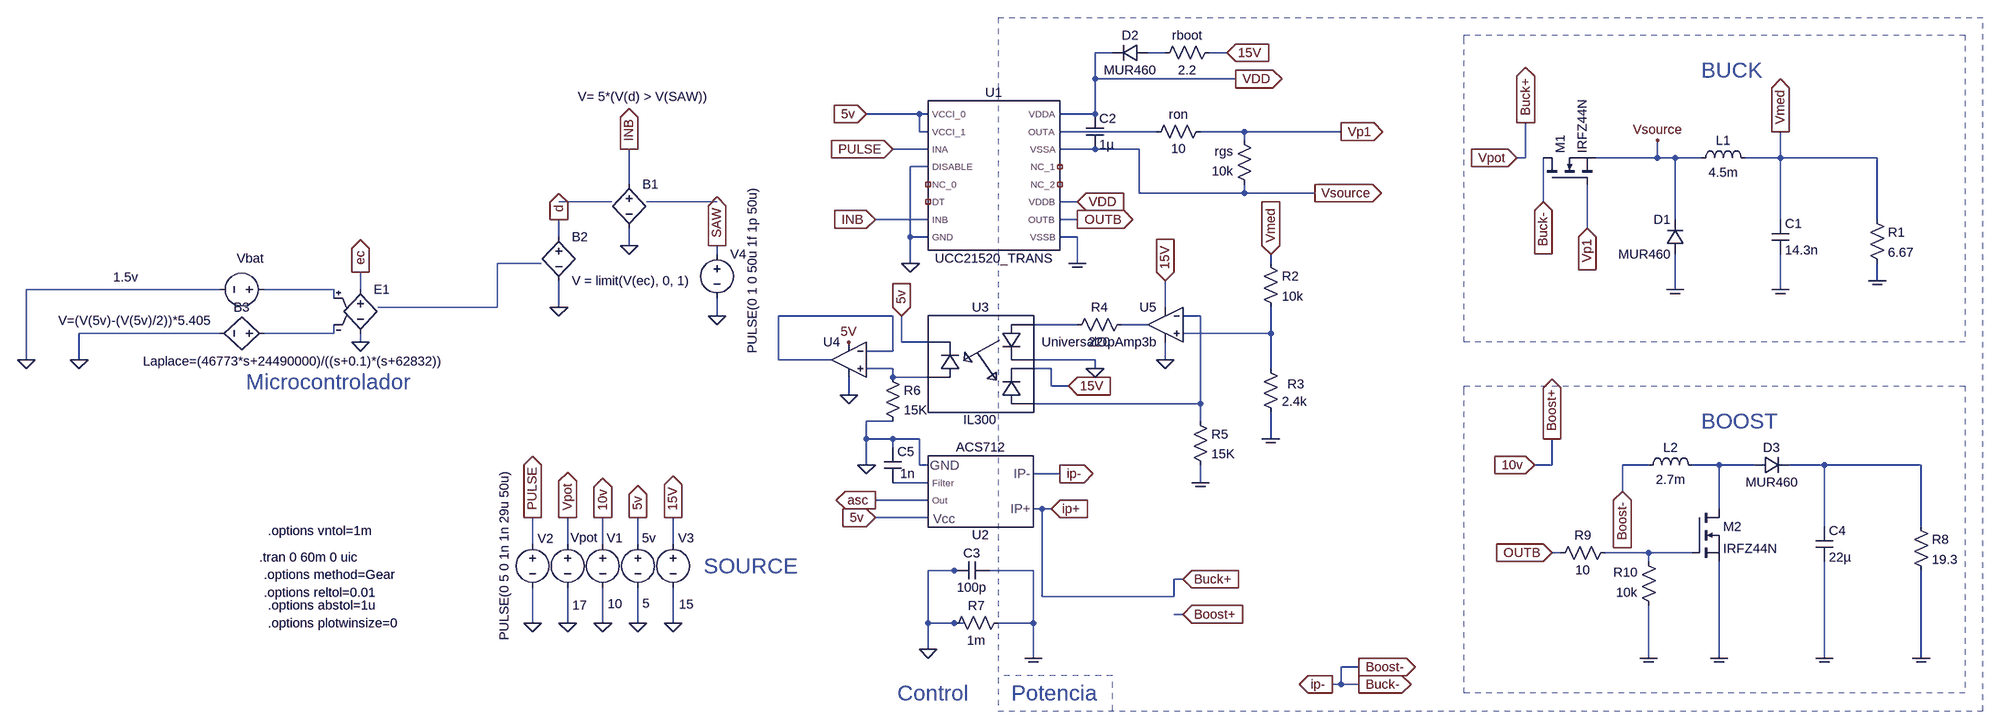
[diagram p0: schematic buckboost.asc]
buckboost.asc, the LTspice schematic file:
Version 4.1
SHEET 1 2232 1744
WIRE 208 192 176 192
WIRE 304 192 272 192
WIRE 416 192 384 192
WIRE 176 240 176 192
WIRE 432 240 176 240
WIRE -144 304 -240 304
WIRE -128 304 -144 304
WIRE 176 304 176 240
WIRE 176 304 112 304
WIRE -144 336 -144 304
WIRE -128 336 -144 336
WIRE 288 336 112 336
WIRE 448 336 368 336
WIRE 624 336 448 336
WIRE 448 352 448 336
WIRE -128 368 -192 368
WIRE 176 368 112 368
WIRE 256 368 176 368
WIRE 960 384 960 320
WIRE 960 384 944 384
WIRE 1200 384 1200 352
WIRE 1200 384 1088 384
WIRE 1232 384 1200 384
WIRE 1280 384 1232 384
WIRE 1424 384 1424 336
WIRE 1424 384 1360 384
WIRE 1600 384 1424 384
WIRE -128 400 -160 400
WIRE -672 432 -672 368
WIRE 256 448 256 368
WIRE 448 448 448 432
WIRE 448 448 256 448
WIRE 576 448 448 448
WIRE 144 464 112 464
WIRE 992 464 992 384
WIRE -128 496 -224 496
WIRE 144 496 112 496
WIRE 1232 496 1232 384
WIRE 1424 496 1424 384
WIRE 1600 496 1600 384
WIRE 1072 512 1072 432
WIRE -800 528 -800 496
WIRE -160 528 -160 400
WIRE -128 528 -160 528
WIRE 144 528 112 528
WIRE -672 544 -672 512
WIRE -512 560 -512 544
WIRE -160 576 -160 528
WIRE 144 576 144 528
WIRE 496 576 496 560
WIRE 1600 608 1600 576
WIRE -1424 624 -1776 624
WIRE -1216 624 -1344 624
WIRE -1168 624 -1168 592
WIRE 1232 624 1232 560
WIRE 1424 624 1424 560
WIRE -1216 640 -1216 624
WIRE -800 656 -800 608
WIRE 304 656 304 608
WIRE -512 672 -512 640
WIRE -192 672 -400 672
WIRE 368 672 336 672
WIRE 144 688 64 688
WIRE 272 688 224 688
WIRE -1424 704 -1680 704
WIRE -1216 704 -1216 688
WIRE -1216 704 -1344 704
WIRE 496 704 496 656
WIRE 496 704 336 704
WIRE -1168 720 -1168 704
WIRE -176 720 -176 672
WIRE -128 720 -176 720
WIRE -192 736 -192 672
WIRE -192 736 -240 736
WIRE -1776 752 -1776 624
WIRE -1680 752 -1680 704
WIRE -400 752 -400 672
WIRE -304 752 -400 752
WIRE 176 752 64 752
WIRE 304 752 304 720
WIRE -192 768 -240 768
WIRE 96 768 64 768
WIRE 176 768 176 752
WIRE 496 768 496 704
WIRE -192 784 -192 768
WIRE -128 784 -192 784
WIRE 96 800 96 768
WIRE 128 800 96 800
WIRE -272 816 -272 784
WIRE 368 832 368 672
WIRE 368 832 64 832
WIRE -192 864 -240 864
WIRE 368 864 368 832
WIRE -240 896 -240 864
WIRE -192 896 -240 896
WIRE -144 896 -192 896
WIRE 496 896 496 848
WIRE -192 912 -192 896
WIRE -240 944 -240 896
WIRE -144 944 -144 896
WIRE -128 944 -144 944
WIRE 1008 944 1008 896
WIRE 1008 944 976 944
WIRE 1184 944 1136 944
WIRE 1312 944 1264 944
WIRE 1376 944 1312 944
WIRE 1504 944 1440 944
WIRE 1680 944 1504 944
WIRE 112 960 64 960
WIRE -128 976 -192 976
WIRE 368 976 368 944
WIRE 1136 992 1136 944
WIRE -128 1008 -224 1008
WIRE 80 1024 64 1024
WIRE 96 1024 80 1024
WIRE 1312 1024 1312 944
WIRE -128 1040 -224 1040
WIRE 1504 1056 1504 944
WIRE 1680 1056 1680 944
WIRE -848 1088 -848 1040
WIRE -784 1088 -784 1040
WIRE -720 1088 -720 1040
WIRE -656 1088 -656 1040
WIRE -592 1088 -592 1040
WIRE 1024 1104 1008 1104
WIRE 1184 1104 1104 1104
WIRE 1264 1104 1184 1104
WIRE 1184 1120 1184 1104
WIRE -80 1136 -128 1136
WIRE -64 1136 -80 1136
WIRE 64 1136 -16 1136
WIRE 336 1152 320 1152
WIRE 80 1184 80 1024
WIRE 320 1184 320 1152
WIRE 320 1184 80 1184
WIRE 336 1216 320 1216
WIRE -848 1232 -848 1168
WIRE -784 1232 -784 1168
WIRE -720 1232 -720 1168
WIRE -656 1232 -656 1168
WIRE -592 1232 -592 1168
WIRE -128 1232 -128 1136
WIRE -80 1232 -128 1232
WIRE -64 1232 -80 1232
WIRE 64 1232 64 1136
WIRE 64 1232 0 1232
WIRE -128 1280 -128 1232
WIRE 64 1296 64 1232
WIRE 1184 1296 1184 1200
WIRE 1312 1296 1312 1120
WIRE 1504 1296 1504 1120
WIRE 1680 1296 1680 1136
WIRE 656 1312 624 1312
WIRE 624 1344 624 1312
WIRE 624 1344 608 1344
WIRE 656 1344 624 1344
FLAG 1232 624 COM
FLAG -848 1232 0
FLAG -848 1040 PULSE
IOPIN -848 1040 Out
FLAG -192 368 PULSE
IOPIN -192 368 In
FLAG -240 304 5v
IOPIN -240 304 In
FLAG -656 1040 5v
IOPIN -656 1040 Out
FLAG 1072 512 Vp1
IOPIN 1072 512 In
FLAG -592 1232 0
FLAG 144 576 COM
FLAG 432 240 VDD
IOPIN 432 240 Out
FLAG 144 464 VDD
IOPIN 144 464 In
FLAG 624 336 Vp1
IOPIN 624 336 Out
FLAG 576 448 Vsource
IOPIN 576 448 Out
FLAG 1200 352 Vsource
FLAG 1424 336 Vmed
IOPIN 1424 336 Out
FLAG 496 560 Vmed
IOPIN 496 560 In
FLAG -592 1040 15V
IOPIN -592 1040 Out
FLAG 128 800 15V
IOPIN 128 800 In
FLAG 496 896 COM
FLAG 368 976 COM
FLAG 304 608 15V
IOPIN 304 608 In
FLAG -272 720 5V
FLAG -272 816 0
FLAG 304 752 0
FLAG -240 944 0
FLAG 176 768 0
FLAG -656 1232 0
FLAG -160 576 0
FLAG -176 672 5v
IOPIN -176 672 In
FLAG 416 192 15V
IOPIN 416 192 In
FLAG -784 1232 0
FLAG 1424 624 COM
FLAG 1600 608 COM
FLAG -784 1040 Vpot
IOPIN -784 1040 Out
FLAG 944 384 Vpot
IOPIN 944 384 In
FLAG -128 1280 0
FLAG 64 1296 COM
FLAG 1312 1296 COM
FLAG 1504 1296 COM
FLAG 1680 1296 COM
FLAG 976 944 10v
IOPIN 976 944 In
FLAG -720 1040 10v
IOPIN -720 1040 Out
FLAG -720 1232 0
FLAG 1184 1296 COM
FLAG 1008 1104 OUTB
IOPIN 1008 1104 In
FLAG 144 496 OUTB
IOPIN 144 496 Out
FLAG -512 672 0
FLAG -512 544 SAW
IOPIN -512 544 Out
FLAG -672 544 0
FLAG -672 368 INB
IOPIN -672 368 Out
FLAG -224 496 INB
IOPIN -224 496 In
FLAG -800 656 0
FLAG -800 496 d
IOPIN -800 496 Out
FLAG -1680 752 0
FLAG -1168 592 ec
IOPIN -1168 592 Out
FLAG -1776 752 0
FLAG -224 1008 asc
IOPIN -224 1008 Out
FLAG 96 1024 ip+
IOPIN 96 1024 In
FLAG 112 960 ip-
IOPIN 112 960 Out
FLAG 1008 896 Boost+
IOPIN 1008 896 Out
FLAG 1136 992 Boost-
IOPIN 1136 992 In
FLAG -224 1040 5v
IOPIN -224 1040 In
FLAG -1168 720 0
FLAG 960 320 Buck+
IOPIN 960 320 Out
FLAG 992 464 Buck-
IOPIN 992 464 In
FLAG 336 1152 Buck+
IOPIN 336 1152 In
FLAG 656 1344 Buck-
IOPIN 656 1344 Out
FLAG 336 1216 Boost+
IOPIN 336 1216 In
FLAG 656 1312 Boost-
IOPIN 656 1312 Out
FLAG 608 1344 ip-
IOPIN 608 1344 Out
SYMBOL voltage -784 1072 R0
WINDOW 123 0 0 Left 0
WINDOW 39 0 0 Left 0
WINDOW 0 5 4 Left 2
WINDOW 3 9 128 Left 2
SYMATTR InstName Vpot
SYMATTR Value 17
SYMBOL voltage -848 1072 R0
WINDOW 123 0 0 Left 0
WINDOW 39 0 0 Left 0
WINDOW 3 -51 -118 VRight 2
WINDOW 0 9 6 Left 2
SYMATTR Value PULSE(0 5 0 1n 1n 29u 50u)
SYMATTR InstName V2
SYMBOL diode 1248 560 R180
WINDOW 0 24 64 Left 2
WINDOW 3 24 0 Left 2
SYMATTR InstName D1
SYMATTR Value MUR460
SYMBOL cap 1408 496 R0
SYMATTR InstName C1
SYMATTR Value 14.3n
SYMBOL ind 1264 400 R270
WINDOW 0 32 56 VTop 2
WINDOW 3 5 56 VBottom 2
SYMATTR InstName L1
SYMATTR Value 4.5m
SYMATTR SpiceLine Rser=1m
SYMBOL res 1584 480 R0
SYMATTR InstName R1
SYMATTR Value 6.67
SYMBOL UCC21520_TRANS -16 416 R0
SYMATTR InstName U1
SYMBOL res 288 208 R270
WINDOW 0 32 56 VTop 2
WINDOW 3 0 56 VBottom 2
SYMATTR InstName rboot
SYMATTR Value 2.2
SYMBOL res 384 320 R90
WINDOW 0 0 56 VBottom 2
WINDOW 3 32 56 VTop 2
SYMATTR InstName ron
SYMATTR Value 10
SYMBOL res 464 448 R180
WINDOW 0 36 76 Left 2
WINDOW 3 36 40 Left 2
SYMATTR InstName rgs
SYMATTR Value 10k
SYMBOL voltage -656 1072 R0
WINDOW 123 0 0 Left 0
WINDOW 39 0 0 Left 0
WINDOW 3 8 124 Left 2
WINDOW 0 7 5 Left 2
SYMATTR Value 5
SYMATTR InstName 5v
SYMBOL nmos 992 432 R270
SYMATTR InstName M1
SYMATTR Value IRFZ44N
SYMBOL diode 272 176 R90
WINDOW 0 0 32 VBottom 2
WINDOW 3 32 32 VTop 2
SYMATTR InstName D2
SYMATTR Value MUR460
SYMBOL voltage -592 1072 R0
WINDOW 123 0 0 Left 0
WINDOW 39 0 0 Left 0
WINDOW 0 9 5 Left 2
WINDOW 3 11 126 Left 2
SYMATTR InstName V3
SYMATTR Value 15
SYMBOL cap 160 304 R0
SYMATTR InstName C2
SYMATTR Value 1µ
SYMBOL res 480 560 R0
SYMATTR InstName R2
SYMATTR Value 10k
SYMBOL res 480 752 R0
WINDOW 0 46 44 Left 2
SYMATTR InstName R3
SYMATTR Value 2.4k
SYMBOL res 240 672 R90
WINDOW 0 0 56 VBottom 2
WINDOW 3 32 56 VTop 2
SYMATTR InstName R4
SYMATTR Value 220
SYMBOL res 352 848 R0
SYMATTR InstName R5
SYMATTR Value 15K
SYMBOL lib\\sym\\OpAmps\\UniversalOpAmp -272 752 M0
SYMATTR InstName U4
SYMBOL res -208 768 R0
SYMATTR InstName R6
SYMATTR Value 15K
SYMBOL OpAmps\\UniversalOpAmp3b 304 688 M0
SYMATTR InstName U5
SYMBOL IL300 -32 752 M0
SYMATTR InstName U3
SYMBOL res 16 1216 R90
WINDOW 0 0 56 VBottom 2
WINDOW 3 32 56 VTop 2
SYMATTR InstName R7
SYMATTR Value 1m
SYMBOL cap -16 1120 R90
WINDOW 0 0 32 VBottom 2
WINDOW 3 32 32 VTop 2
SYMATTR InstName C3
SYMATTR Value 100p
SYMBOL diode 1376 960 R270
WINDOW 0 32 32 VTop 2
WINDOW 3 0 32 VBottom 2
SYMATTR InstName D3
SYMATTR Value MUR460
SYMBOL cap 1488 1056 R0
SYMATTR InstName C4
SYMATTR Value 22µ
SYMBOL ind 1168 960 R270
WINDOW 0 32 56 VTop 2
WINDOW 3 5 56 VBottom 2
SYMATTR InstName L2
SYMATTR Value 2.7m
SYMATTR SpiceLine Rser=1m
SYMBOL res 1664 1040 R0
SYMATTR InstName R8
SYMATTR Value 19.3
SYMBOL nmos 1264 1024 R0
SYMATTR InstName M2
SYMATTR Value IRFZ44N
SYMBOL voltage -720 1072 R0
WINDOW 123 0 0 Left 0
WINDOW 39 0 0 Left 0
WINDOW 3 9 125 Left 2
WINDOW 0 7 5 Left 2
SYMATTR Value 10
SYMATTR InstName V1
SYMBOL res 1120 1088 R90
WINDOW 0 0 56 VBottom 2
WINDOW 3 32 56 VTop 2
SYMATTR InstName R9
SYMATTR Value 10
SYMBOL res 1200 1216 R180
WINDOW 0 36 76 Left 2
WINDOW 3 36 40 Left 2
SYMATTR InstName R10
SYMATTR Value 10k
SYMBOL voltage -512 544 R0
WINDOW 123 0 0 Left 0
WINDOW 39 0 0 Left 0
WINDOW 3 65 -107 VRight 2
SYMATTR Value PULSE(0 1 0 50u 1f 1p 50u)
SYMATTR InstName V4
SYMBOL e -1168 608 R0
WINDOW 3 -396 147 Left 2
SYMATTR Value Laplace=(46773*s+24490000)/((s+0.1)*(s+62832))
SYMATTR InstName E1
SYMBOL voltage -1328 624 R90
WINDOW 123 0 0 Left 0
WINDOW 39 0 0 Left 0
WINDOW 0 -57 15 VRight 2
WINDOW 3 -23 244 VRight 2
SYMATTR InstName Vbat
SYMATTR Value 1.5v
SYMBOL ACS712 -32 992 R180
SYMATTR InstName U2
SYMBOL cap -208 912 R0
WINDOW 3 29 48 Left 2
SYMATTR Value 1n
SYMATTR InstName C5
SYMBOL sym\\bv -672 416 R0
WINDOW 3 -93 -144 Left 2
SYMATTR Value V= 5*(V(d) > V(SAW))
SYMATTR InstName B1
SYMBOL sym\\bv -800 512 R0
SYMATTR InstName B2
SYMATTR Value V = limit(V(ec), 0, 1)
SYMBOL sym\\bv -1328 704 R90
WINDOW 0 -32 56 VBottom 2
WINDOW 3 -39 251 VTop 2
SYMATTR InstName B3
SYMATTR Value V=(V(5v)-(V(5v)/2))*5.405
TEXT -1352 1112 Left 2 !.tran 0 60m 0 uic
TEXT -1336 1064 Left 2 !.options vntol=1m
TEXT -1344 1144 Left 2 !.options method=Gear
TEXT -1344 1176 Left 2 !.options reltol=0.01
TEXT -1336 1200 Left 2 !.options abstol=1u
TEXT -1336 1232 Left 2 !.options plotwinsize=0
TEXT -184 1360 Left 4 ;Control
TEXT -1376 792 Left 4 ;Microcontrolador
TEXT 24 1360 Left 4 ;Potencia
TEXT 1280 224 Left 4 ;BUCK
TEXT 1280 864 Left 4 ;BOOST
TEXT -536 1128 Left 4 ;SOURCE
LINE Normal 848 720 848 176 3
LINE Normal 1760 720 848 720 3
LINE Normal 1760 160 1760 720 3
LINE Normal 848 160 1760 160 3
LINE Normal 848 176 848 160 3
LINE Normal 848 1360 848 816 3
LINE Normal 1760 1360 848 1360 3
LINE Normal 1760 800 1760 1360 3
LINE Normal 848 800 1760 800 3
LINE Normal 848 816 848 800 3
LINE Normal 0 128 1792 128 3
LINE Normal 1792 1392 1792 128 3
LINE Normal 0 1392 1792 1392 3
LINE Normal 0 128 0 1392 3
LINE Normal 208 1328 0 1328 3
LINE Normal 208 1392 208 1328 3
LINE Normal -800 464 -704 464
LINE Normal -512 464 -640 464
LINE Normal -912 656 -1136 656
LINE Normal -912 576 -912 656
LINE Normal -832 576 -912 576

The netlist it stands for:
* buckboost.asc
Vpot Buck+ 0 17
V2 PULSE 0 PULSE(0 5 0 1n 1n 29u 50u)
D1 COM Vsource MUR460
C1 Vmed COM 14.3n
L1 Vsource Vmed 4.5m Rser=1m
R1 Vmed COM 6.67
X§U1 0 NC_01 0 PULSE INB N002 OUTB 5v 5v VDD VDD Vsource COM NC_02 NC_03 NC_04 UCC21520_TRANS  ; pins DISABLE DT GND INA INB OUTA OUTB VCCI_0 VCCI_1 VDDA VDDB VSSA VSSB NC_0 NC_1 NC_2
rboot N001 15V 2.2
ron Vp1 N002 10
rgs Vsource Vp1 10k
V§5v 5v 0 5
M1 Buck- Vp1 Vsource Vsource IRFZ44N
D2 N001 VDD MUR460
V3 15V 0 15
C2 VDD Vsource 1µ
R2 Vmed N009 10k
R3 N009 COM 2.4k
R4 N007 N006 220
R5 N005 COM 15K
X§U4 N010 N004 5v 0 N004 level1 Avol=1Meg GBW=10Meg Vos=0 En=0 Enk=0 In=0 Ink=0 Rin=500Meg  ; pins In+ In- V+ V- OUT
R6 N010 0 15K
* U5: UniversalOpAmp3b (symbol OpAmps\UniversalOpAmp3b not available, pins judged from their places): In+=N009 In-=N005 V+=15V V-=0 OUT=N007
X§U3 0 N006 15V N005 N010 5v IL300  ; pins LEDC LEDA PD1C PD1A PD2A PD2C
R7 COM 0 1m
C3 COM 0 100p
D3 N011 N012 MUR460
C4 N012 COM 22µ
L2 Buck- N011 2.7m Rser=1m
R8 N012 COM 19.3
M2 N011 N014 COM COM IRFZ44N
V1 Boost+ 0 10
R9 N014 OUTB 10
R10 COM N014 10k
V4 SAW 0 PULSE(0 1 0 50u 1f 1p 50u)
E1 ec 0 N003 N008 Laplace=(46773*s+24490000)/((s+0.1)*(s+62832))
Vbat N003 0 1.5v
X§U2 Buck+ Buck- N013 asc 5v 0 ACS712  ; pins I+ I- Filter Out V+ V-
C5 0 N013 1n
B1 INB 0 V= 5*(V(d) > V(SAW))
B2 d 0 V = limit(V(ec), 0, 1)
B3 N008 0 V=(V(5v)-(V(5v)/2))*5.405
.model D D
.lib standard.dio
.model NMOS NMOS
.model PMOS PMOS
.lib standard.mos
.tran 0 60m 0 uic
.options vntol=1m
.options method=Gear
.options reltol=0.01
.options abstol=1u
.options plotwinsize=0
* Control
* Microcontrolador
* Potencia
* BUCK
* BOOST
* SOURCE
.lib UCC21520_TRANS.lib
.lib UniversalOpAmp1.lib
.lib IL300.SUB
.lib ACS712.lib
.backanno
.end